# EAGLE design microSD_Shield-v13 (EAGLE 5.01)
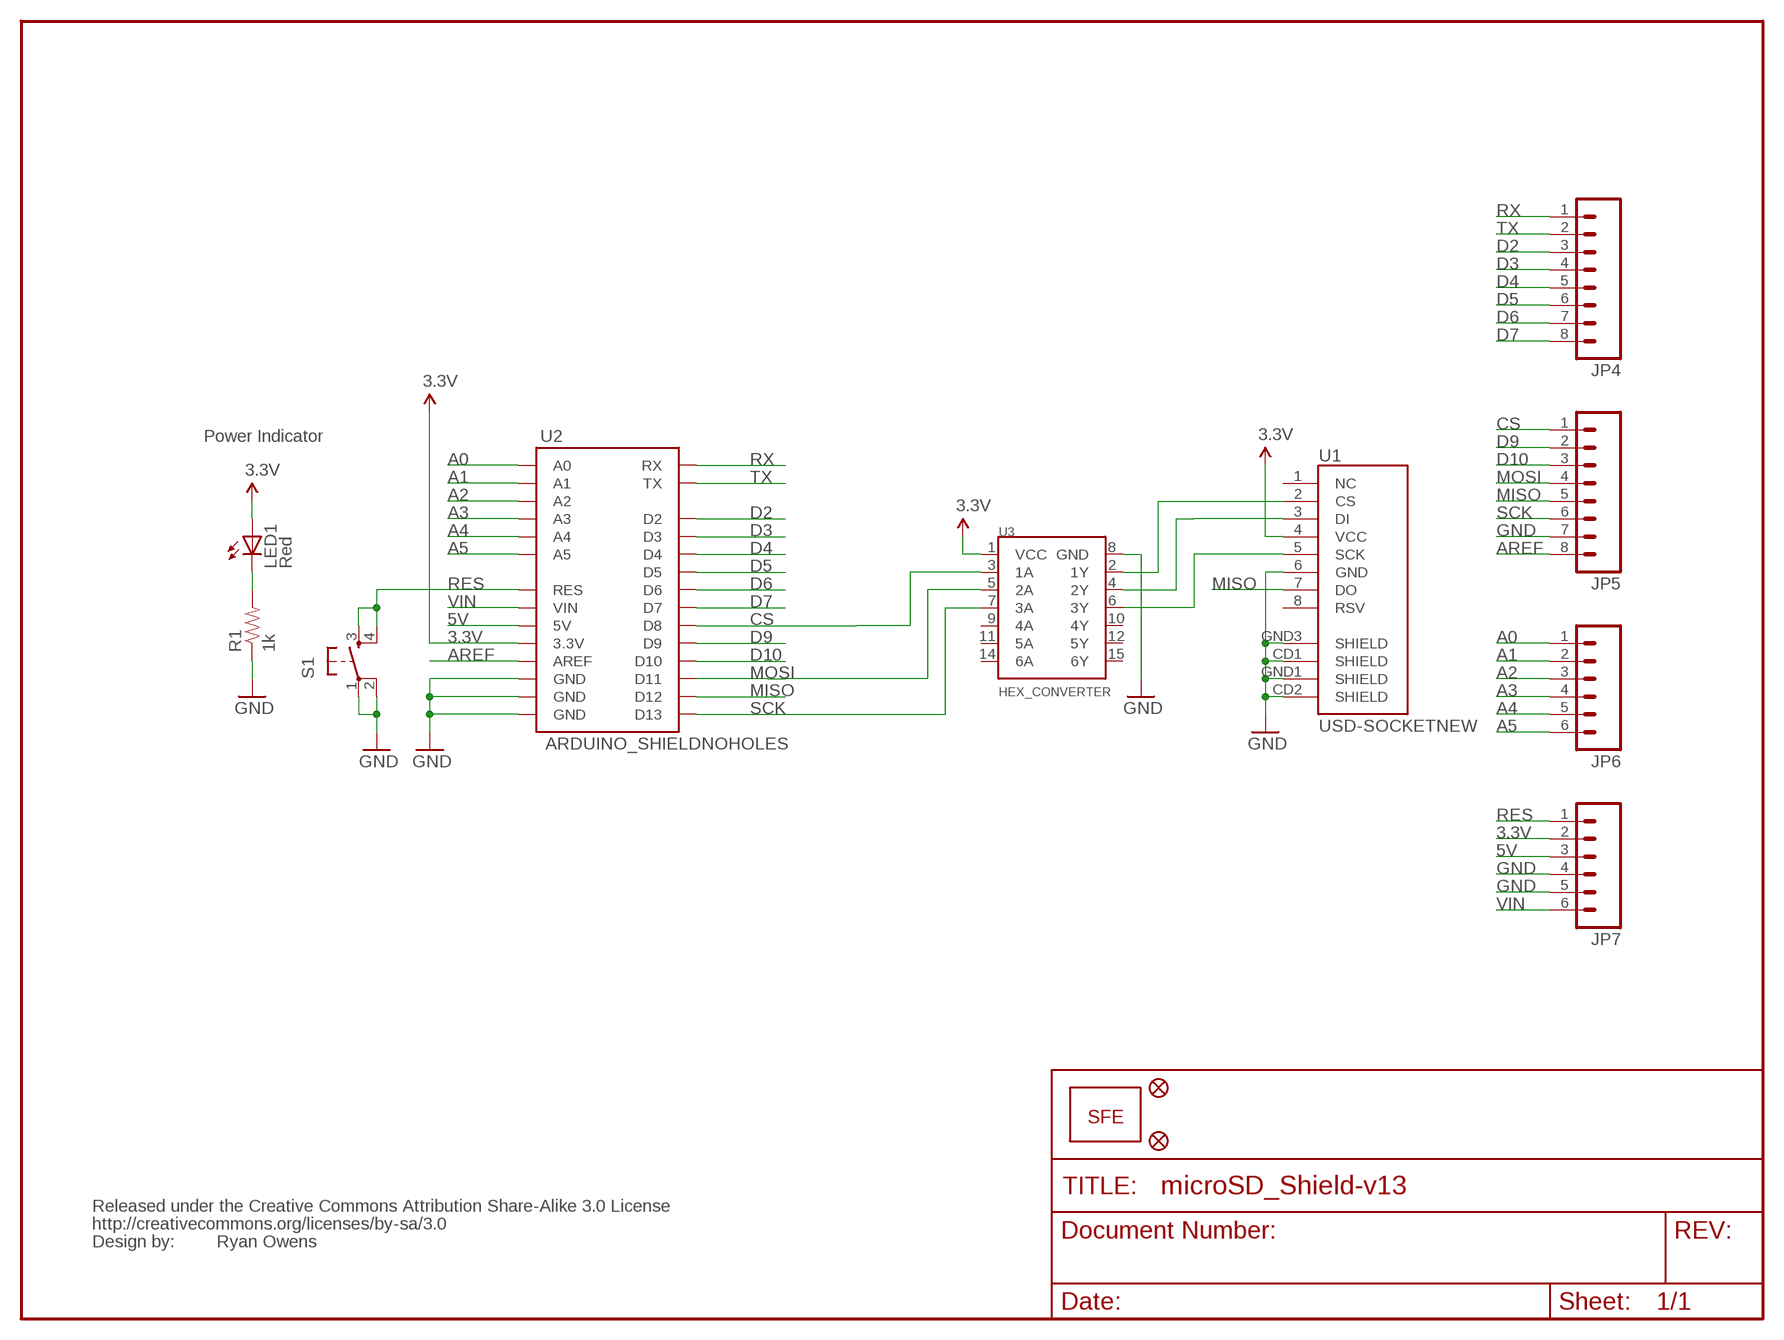
[diagram p0: schematic, sheet 1]

## Parts
JP1  LOGO-SFENEW  [SFE-NEW-WEBLOGO]
JP2  FIDUCIAL1X2  [FIDUCIAL-1X2]
JP3  FIDUCIAL1X2  [FIDUCIAL-1X2]
JP4  M08  [1X08]
JP5  M08  [1X08]
JP6  M06SIP  [1X06]
JP7  M06SIP  [1X06]
LED1  Red  LED0603  [LED-0603]
R1  1k  RESISTOR0603-RES  [0603-RES]
S1  TAC_SWITCHSMD  [TACTILE_SWITCH_SMD]
U1  USD-SOCKETNEW  [MICRO-SD-SOCKET-PP]
U2  ARDUINO_SHIELDNOHOLES  [DUEMILANOVE_SHIELD_NOHOLES]
U3  HEX_CONVERTER  [SO016]
U$1  CREATIVE_COMMONS  [CREATIVE_COMMONS]

## Nets
3.3V: JP7.2 LED1.A U1.4(VCC) U2.3.3V U3.1(VCC)
5V: JP7.3 U2.5V
A0: JP6.1 U2.A0
A1: JP6.2 U2.A1
A2: JP6.3 U2.A2
A3: JP6.4 U2.A3
A4: JP6.5 U2.A4
A5: JP6.6 U2.A5
AREF: JP5.8 U2.AREF
CS: JP5.1 U2.D8 U3.3(1A)
D2: JP4.3 U2.D2
D3: JP4.4 U2.D3
D4: JP4.5 U2.D4
D5: JP4.6 U2.D5
D6: JP4.7 U2.D6
D7: JP4.8 U2.D7
D9: JP5.2 U2.D9
D10: JP5.3 U2.D10
GND: JP5.7 JP7.4 JP7.5 R1.1 S1.1 S1.2 U1.6(GND) U1.CD1(SHIELD) U1.CD2(SHIELD) U1.GND1(SHIELD) U1.GND3(SHIELD) U2.GND@0(GND) U2.GND@1(GND) U2.GND@2(GND) U3.8(GND)
MISO: JP5.5 U1.7(DO) U2.D12
MOSI: JP5.4 U2.D11 U3.5(2A)
N$2: U1.3(DI) U3.4(2Y)
N$4: U1.5(SCK) U3.6(3Y)
N$6: LED1.C R1.2
N$163: U1.2(CS) U3.2(1Y)
RES: JP7.1 S1.3 S1.4 U2.RES
RX: JP4.1 U2.RX
SCK: JP5.6 U2.D13 U3.7(3A)
TX: JP4.2 U2.TX
VIN: JP7.6 U2.VIN
Unconnected: U1.1(NC) U1.8(RSV) U3.9(4A) U3.10(4Y) U3.11(5A) U3.12(5Y) U3.14(6A) U3.15(6Y)

## Notes on the sheet
- Power Indicator
- Ryan Owens

## Library data of the parts
JP1 = SparkFun:LOGO-SFE: Spark Fun Electronics PCB Logo This is the standard Spark Fun Electronics PCB logo.
JP2 JP3 = SparkFun:FIDUCIAL: Fiducial Alignment Points Various fiducial points for machine vision alignment.
JP4 JP5 = SparkFun:M08: Header 8 Standard 8-pin 0.1" header. Use with straight break away headers (SKU : PRT-00116), right angle break away headers (PRT-00553), swiss pins (PRT-00743), machine pins (PRT-00117), and female headers (PRT-00115).
JP6 JP7 = SparkFun:M06: Header 6 Standard 6-pin 0.1" header. Use with straight break away headers (SKU : PRT-00116), right angle break away headers (PRT-00553), swiss pins (PRT-00743), machine pins (PRT-00117), and female headers (PRT-00115). Molex polarized connector foot print use with SKU : PRT-08094 with associated crimp pins and housings. NOTES ON THE VARIANTS LOCK and LOCK_LONGPADS... This footprint was designed to help hold the alignment of a through-hole component (i.e. 6-pin header) while soldering it into place. You may notice that each hole has been shifted either up or down by 0.005 of an inch from it's more standard position (which is a perfectly straight line). This slight alteration caused the pins (the squares in the middle) to touch the edges of the holes. Because they are alternating, it causes a "brace" to hold the component in place. 0.005 has proven to be the perfect amount of "off-center" position when using our standard breakaway headers. Although looks a little odd when you look at the bare footprint, once you have a header in there, the alteration is very hard to notice. Also, if you push a header all the way into place, it is covered up entirely on the bottom side. This idea of altering the position of holes to aid alignment will be further integrated into the Sparkfun Library for other footprints. It can help hold any component with 3 or more connection pins.
LED1 = SparkFun:LED: LEDs Standard schematic elements and footprints for 5mm, 3mm, 1206, and 0603 sized LEDs. 5mm - Spark Fun Electronics SKU : COM-00529 (and others)
R1 = SparkFun:RESISTOR: Resistor Basic schematic elements and footprints for 0603, 1206, and PTH 1/10th watt (small) resistors.
S1 = SparkFun:TAC_SWITCH: Momentary Switch Button commonly used for reset or general input. Spark Fun Electronics SKU : COM-00097
U1 = SparkFun:USD-SOCKET: microSD Socket Push-push type uSD socket. Schematic element and footprint production proven. Spark Fun Electronics SKU : PRT-00127. tDoc lines correctly indicate media card edge positions when inserting (unlocked, locked, depressed).
U2 = SparkFun:ARDUINO_SHIELD
U3 = SparkFun:HEX_CONVERTER
U$1 = SparkFun:CREATIVE_COMMONS

## Board
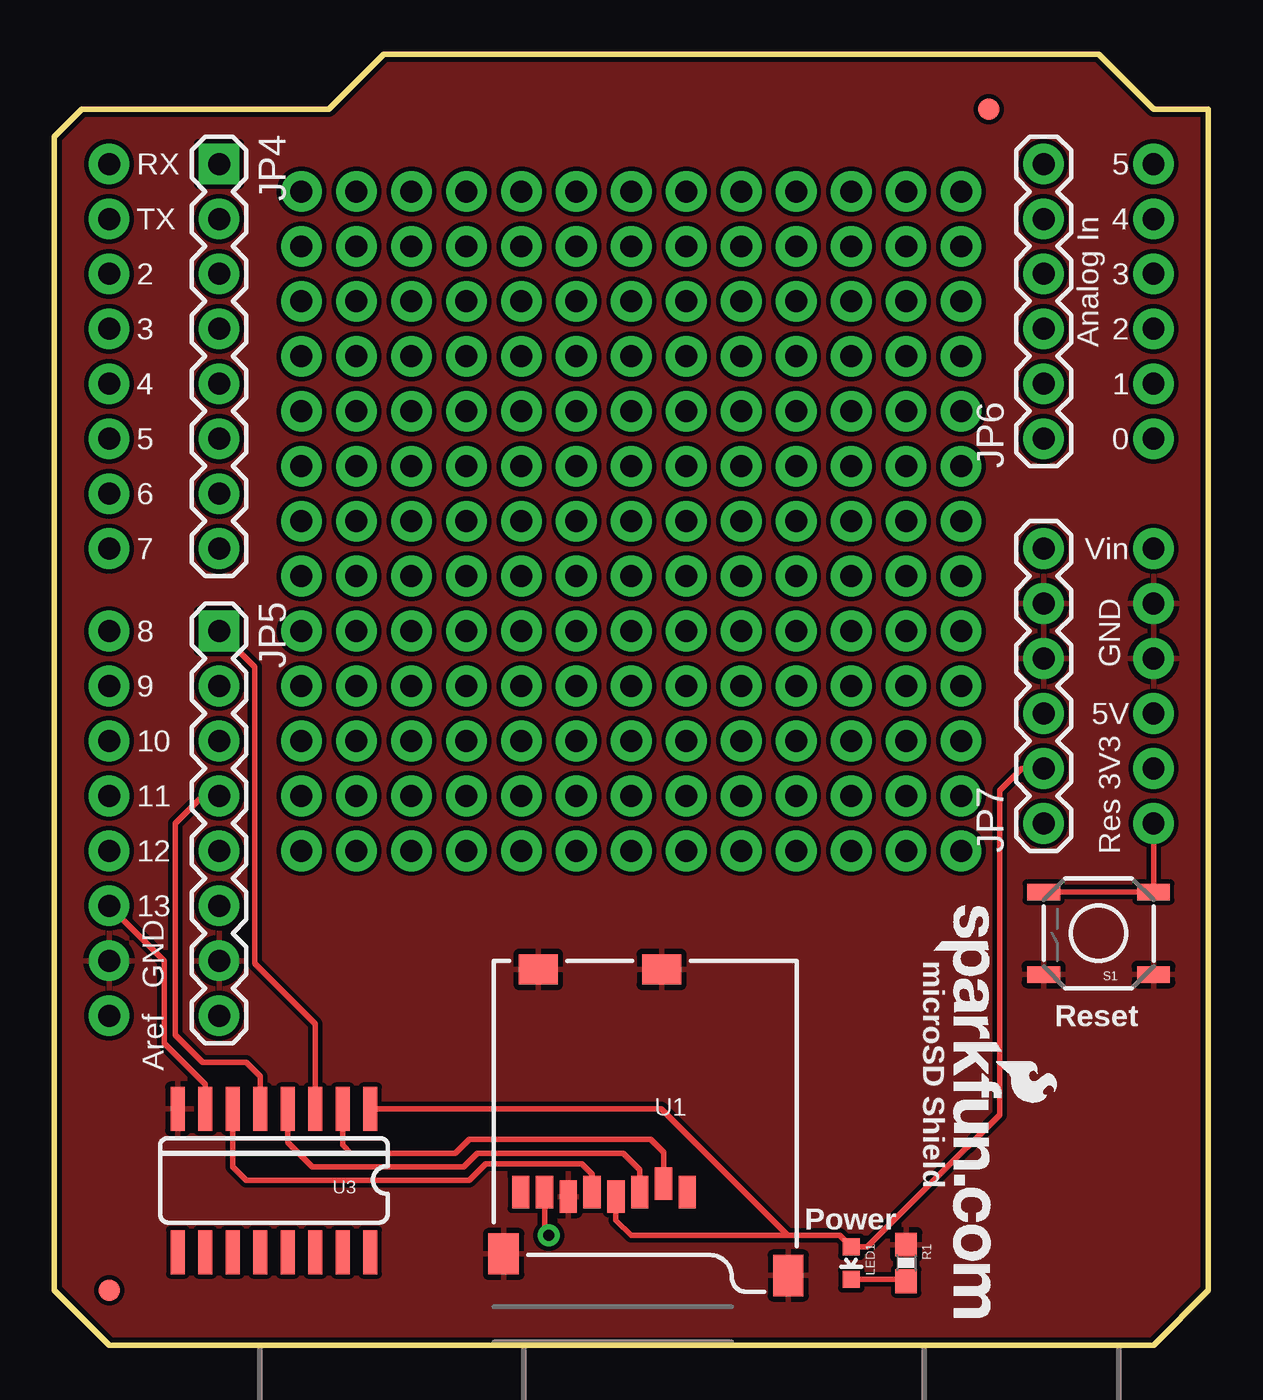
[diagram p1: board, top side]
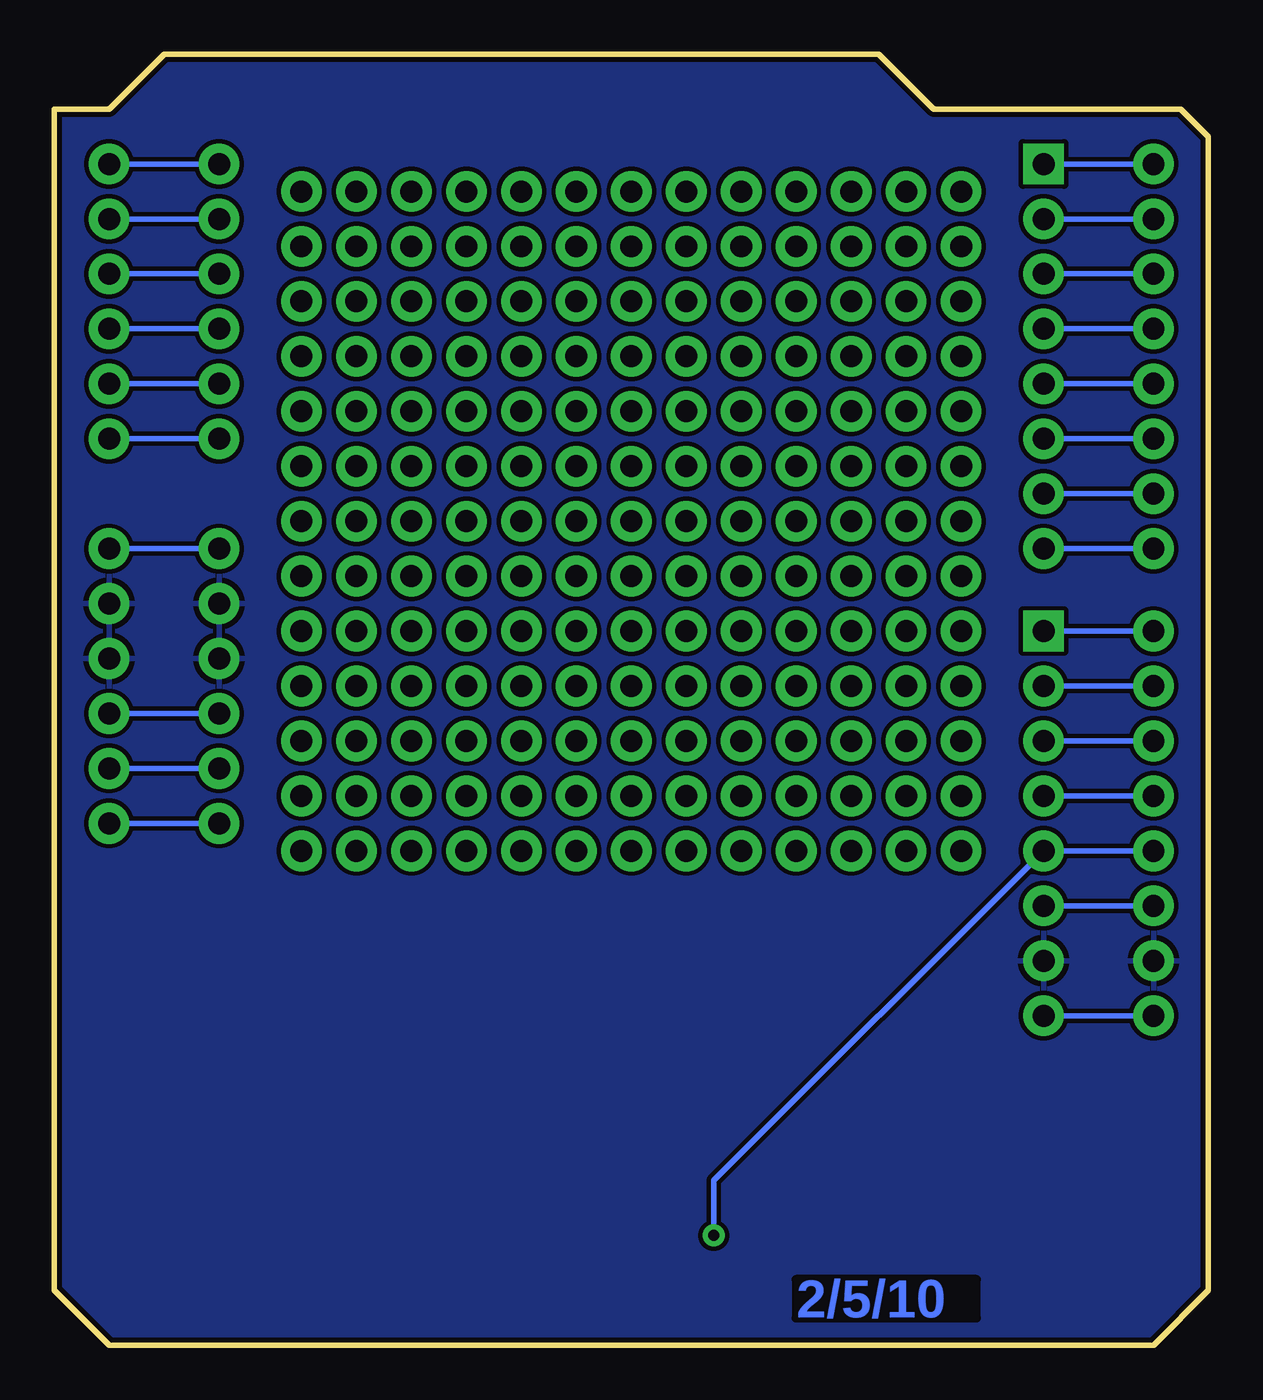
[diagram p2: board, bottom side, seen from below]

Size 53.34 x 59.69 mm. Coordinates in mm from the lower left corner, seen from the top.
Outline: 0,2.54 0,55.88 1.27,57.15 12.7,57.15 15.24,59.69 48.26,59.69 50.8,57.15 53.34,57.15 53.34,2.54 50.8,0 34.29,0 2.54,0 0,2.54
Copper layers (1*16): Top 0.035mm / dielectric 1.5mm / Bottom 0.035mm
Design rules "SparkFun": minimum track width 8mil, minimum drill 20mil, track to track 8mil, track to pad 8mil, pad to pad 8mil, via to via 8mil, smd to smd 8mil, copper to edge 9mil, drill to drill 8mil, minimum pad ring 12mil, minimum via ring 10mil, stop-mask expansion 4mil, vias tented up to drill 20mil, thermal gap 10mil

### Footprints (pad centres in the part's own frame; a part is rotated, then mirrored left to right if it is on the bottom)
FIDUCIAL-1X2 = smd 1 x 1: 1 0,0
1X08 = drill 1.016 pad 1.88 square: 1 0,0 | drill 1.016 pad 1.88 round: 2 2.54,0; 3 5.08,0; 4 7.62,0; 5 10.16,0; 6 12.7,0; 7 15.24,0; 8 17.78,0
1X06 = drill 1.016 pad 1.88 round: 1 0,0; 2 2.54,0; 3 5.08,0; 4 7.62,0; 5 10.16,0; 6 12.7,0
LED-0603 = smd 0.8 x 0.8: A 0,-0.75; C 0,0.75
0603-RES = smd 1.1 x 1: 1 -0.85,0; 2 0.85,0
TACTILE_SWITCH_SMD = smd 1.524 x 0.762: 1 -2.54,1.905; 2 2.54,1.905; 3 -2.54,-1.905; 4 2.54,-1.905
MICRO-SD-SOCKET-PP = smd 0.8 x 1.5: 1 -8.94,10.7; 2 -7.84,10.3; 3 -6.74,10.7; 4 -5.64,10.9; 5 -4.54,10.7; 6 -3.44,10.9; 7 -2.34,10.7; 8 -1.24,10.7 | smd 1.8 x 1.4: CD1 -2.05,0.4; CD2 -7.75,0.4 | smd 1.4 x 1.9: GND1 -13.6,14.55; GND3 -0.45,13.55
DUEMILANOVE_SHIELD_NOHOLES = drill 1.016 pad 1.88 round: 3.3V 50.8,26.67; 5V 50.8,29.21; A0 50.8,41.91; A1 50.8,44.45; A2 50.8,46.99; A3 50.8,49.53; A4 50.8,52.07; A5 50.8,54.61; AREF 2.54,15.24; D2 2.54,49.53; D3 2.54,46.99; D4 2.54,44.45; D5 2.54,41.91; D6 2.54,39.37; D7 2.54,36.83; D8 2.54,33.02; D9 2.54,30.48; D10 2.54,27.94; D11 2.54,25.4; D12 2.54,22.86; D13 2.54,20.32; GND@0 50.8,31.75; GND@1 50.8,34.29; GND@2 2.54,17.78; RES 50.8,24.13; RX 2.54,54.61; TX 2.54,52.07; VIN 50.8,36.83
SO016 = smd 0.66 x 2.032: 1 -4.445,-3.315; 2 -3.175,-3.315; 3 -1.905,-3.315; 4 -0.635,-3.315; 5 0.635,-3.315; 6 1.905,-3.315; 7 3.175,-3.315; 8 4.445,-3.315; 9 4.445,3.315; 10 3.175,3.315; 11 1.905,3.315; 12 0.635,3.315; 13 -0.635,3.315; 14 -1.905,3.315; 15 -3.175,3.315; 16 -4.445,3.315

### Placement (x,y rotation side)
JP1  40.64,20.32 270 top
JP2  2.54,2.54 0 top
JP3  43.18,57.15 0 top
JP4  7.62,54.61 270 top
JP5  7.62,33.02 270 top
JP6  45.72,41.91 90 top
JP7  45.72,24.13 90 top
LED1  36.83,3.81 180 top
R1  39.37,3.81 270 top
S1  48.26,19.05 180 top
U1  20.32,17.78 180 top
U2  0,0 0 top
U3  10.16,7.62 180 top
U$1  0,-11.43 0 top  (outside the outline)

### Tracks (layer width: path | path; a pad name or v marks a point on that pad's centre or on a via)
3.3V
  Top 0.254: U1.4 25.96,5.79 26.67,5.08 33.91,5.08 | 33.91,5.08 36.31,5.08 LED1.A 37.58,4.56 40.64,7.62 43.69,10.67 43.69,25.65 44.7,26.67 JP7.2 | U3.1 28.05,10.94 33.91,5.08
  Bottom 0.254: JP7.2 U2.3.3V
5V
  Bottom 0.254: JP7.3 U2.5V
A0
  Bottom 0.254: JP6.1 U2.A0
A1
  Bottom 0.254: JP6.2 U2.A1
A2
  Bottom 0.254: JP6.3 U2.A2
A3
  Bottom 0.254: JP6.4 U2.A3
A4
  Bottom 0.254: JP6.5 U2.A4
A5
  Bottom 0.254: JP6.6 U2.A5
AREF
  Bottom 0.254: U2.AREF JP5.8
CS
  Top 0.254: U3.3 12.06,14.61 12.06,14.86 9.53,17.4 9.27,17.65 9.27,30.1 9.27,31.37 JP5.1
  Bottom 0.254: JP5.1 U2.D8
D2
  Bottom 0.254: U2.D2 JP4.3
D3
  Bottom 0.254: U2.D3 JP4.4
D4
  Bottom 0.254: U2.D4 JP4.5
D5
  Bottom 0.254: U2.D5 JP4.6
D6
  Bottom 0.254: U2.D6 JP4.7
D7
  Bottom 0.254: U2.D7 JP4.8
D9
  Bottom 0.254: U2.D9 JP5.2
D10
  Bottom 0.254: U2.D10 JP5.3
GND
  pour Bottom: 2.54,0 0,2.54 0,55.88 1.27,57.15 12.7,57.15 15.24,59.69 48.26,59.69 50.8,57.15 53.34,57.15 53.34,2.54 50.8,0
  pour Top: 2.54,0 0,2.54 0,55.88 1.27,57.15 12.7,57.15 15.24,59.69 48.26,59.69 50.8,57.15 53.34,57.15 53.34,2.54 50.8,0
MISO  (via drill 0.51)
  Top 0.254: U1.7 22.66,5.28 v22.86,5.08
  Bottom 0.254: U2.D12 JP5.5 22.86,7.62 v22.86,5.08
MOSI
  Top 0.254: JP5.4 6.86,25.4 5.59,24.13 5.59,14.35 6.86,13.08 6.98,13.08 8.89,13.08 9.53,12.45 U3.5
  Bottom 0.254: JP5.4 U2.D11
N$2
  Top 0.254: U3.4 10.79,9.4 11.94,8.26 18.92,8.26 19.43,8.76 19.56,8.89 20.7,8.89 21.08,8.89 26.29,8.89 27.06,8.12 U1.3
N$3  (via drill 1.02 pad 1.88)
  other vias: 11.43,53.34
N$4
  Top 0.254: U3.6 8.26,8.26 8.89,7.62 19.18,7.62 19.94,8.38 20.32,8.38 20.7,8.38 24.38,8.38 24.86,7.91 U1.5
N$5  (via drill 1.02 pad 1.88)
  other vias: 41.91,50.8
N$6
  Top 0.254: R1.2 39.37,3.17 39.26,3.06 LED1.C
N$7  (via drill 1.02 pad 1.88)
  other vias: 39.37,50.8
N$9  (via drill 1.02 pad 1.88)
  other vias: 36.83,50.8
N$10  (via drill 1.02 pad 1.88)
  other vias: 34.29,50.8
N$11  (via drill 1.02 pad 1.88)
  other vias: 31.75,50.8
N$12  (via drill 1.02 pad 1.88)
  other vias: 29.21,50.8
N$13  (via drill 1.02 pad 1.88)
  other vias: 26.67,50.8
N$14  (via drill 1.02 pad 1.88)
  other vias: 24.13,50.8
N$15  (via drill 1.02 pad 1.88)
  other vias: 21.59,50.8
N$16  (via drill 1.02 pad 1.88)
  other vias: 19.05,50.8
N$17  (via drill 1.02 pad 1.88)
  other vias: 16.51,50.8
N$18  (via drill 1.02 pad 1.88)
  other vias: 13.97,50.8
N$19  (via drill 1.02 pad 1.88)
  other vias: 11.43,50.8
N$20  (via drill 1.02 pad 1.88)
  other vias: 11.43,48.26
N$21  (via drill 1.02 pad 1.88)
  other vias: 13.97,48.26
N$22  (via drill 1.02 pad 1.88)
  other vias: 16.51,48.26
N$23  (via drill 1.02 pad 1.88)
  other vias: 19.05,48.26
N$24  (via drill 1.02 pad 1.88)
  other vias: 21.59,48.26
N$25  (via drill 1.02 pad 1.88)
  other vias: 24.13,48.26
N$26  (via drill 1.02 pad 1.88)
  other vias: 26.67,48.26
N$27  (via drill 1.02 pad 1.88)
  other vias: 29.21,48.26
N$28  (via drill 1.02 pad 1.88)
  other vias: 31.75,48.26
N$29  (via drill 1.02 pad 1.88)
  other vias: 34.29,48.26
N$30  (via drill 1.02 pad 1.88)
  other vias: 36.83,48.26
N$31  (via drill 1.02 pad 1.88)
  other vias: 39.37,48.26
N$32  (via drill 1.02 pad 1.88)
  other vias: 41.91,48.26
N$33  (via drill 1.02 pad 1.88)
  other vias: 41.91,45.72
N$34  (via drill 1.02 pad 1.88)
  other vias: 39.37,45.72
N$35  (via drill 1.02 pad 1.88)
  other vias: 36.83,45.72
N$36  (via drill 1.02 pad 1.88)
  other vias: 34.29,45.72
N$37  (via drill 1.02 pad 1.88)
  other vias: 31.75,45.72
N$38  (via drill 1.02 pad 1.88)
  other vias: 29.21,45.72
N$39  (via drill 1.02 pad 1.88)
  other vias: 26.67,45.72
N$40  (via drill 1.02 pad 1.88)
  other vias: 24.13,45.72
N$41  (via drill 1.02 pad 1.88)
  other vias: 21.59,45.72
N$42  (via drill 1.02 pad 1.88)
  other vias: 19.05,45.72
N$43  (via drill 1.02 pad 1.88)
  other vias: 16.51,45.72
N$44  (via drill 1.02 pad 1.88)
  other vias: 13.97,45.72
N$45  (via drill 1.02 pad 1.88)
  other vias: 11.43,45.72
N$46  (via drill 1.02 pad 1.88)
  other vias: 11.43,43.18
N$47  (via drill 1.02 pad 1.88)
  other vias: 13.97,43.18
N$48  (via drill 1.02 pad 1.88)
  other vias: 16.51,43.18
N$49  (via drill 1.02 pad 1.88)
  other vias: 19.05,43.18
N$50  (via drill 1.02 pad 1.88)
  other vias: 21.59,43.18
N$51  (via drill 1.02 pad 1.88)
  other vias: 24.13,43.18
N$52  (via drill 1.02 pad 1.88)
  other vias: 26.67,43.18
N$53  (via drill 1.02 pad 1.88)
  other vias: 29.21,43.18
N$54  (via drill 1.02 pad 1.88)
  other vias: 31.75,43.18
N$55  (via drill 1.02 pad 1.88)
  other vias: 34.29,43.18
N$56  (via drill 1.02 pad 1.88)
  other vias: 36.83,43.18
N$57  (via drill 1.02 pad 1.88)
  other vias: 39.37,43.18
N$58  (via drill 1.02 pad 1.88)
  other vias: 41.91,43.18
N$59  (via drill 1.02 pad 1.88)
  other vias: 41.91,40.64
N$60  (via drill 1.02 pad 1.88)
  other vias: 39.37,40.64
N$61  (via drill 1.02 pad 1.88)
  other vias: 36.83,40.64
N$62  (via drill 1.02 pad 1.88)
  other vias: 34.29,40.64
N$63  (via drill 1.02 pad 1.88)
  other vias: 31.75,40.64
N$64  (via drill 1.02 pad 1.88)
  other vias: 29.21,40.64
N$65  (via drill 1.02 pad 1.88)
  other vias: 26.67,40.64
N$66  (via drill 1.02 pad 1.88)
  other vias: 24.13,40.64
N$67  (via drill 1.02 pad 1.88)
  other vias: 21.59,40.64
N$68  (via drill 1.02 pad 1.88)
  other vias: 19.05,40.64
N$69  (via drill 1.02 pad 1.88)
  other vias: 16.51,40.64
N$70  (via drill 1.02 pad 1.88)
  other vias: 13.97,40.64
N$71  (via drill 1.02 pad 1.88)
  other vias: 11.43,40.64
N$72  (via drill 1.02 pad 1.88)
  other vias: 11.43,38.1
N$73  (via drill 1.02 pad 1.88)
  other vias: 13.97,38.1
N$74  (via drill 1.02 pad 1.88)
  other vias: 16.51,38.1
N$75  (via drill 1.02 pad 1.88)
  other vias: 19.05,38.1
N$76  (via drill 1.02 pad 1.88)
  other vias: 21.59,38.1
N$77  (via drill 1.02 pad 1.88)
  other vias: 24.13,38.1
N$78  (via drill 1.02 pad 1.88)
  other vias: 26.67,38.1
N$79  (via drill 1.02 pad 1.88)
  other vias: 29.21,38.1
N$80  (via drill 1.02 pad 1.88)
  other vias: 31.75,38.1
N$81  (via drill 1.02 pad 1.88)
  other vias: 34.29,38.1
N$82  (via drill 1.02 pad 1.88)
  other vias: 36.83,38.1
N$83  (via drill 1.02 pad 1.88)
  other vias: 39.37,38.1
N$84  (via drill 1.02 pad 1.88)
  other vias: 41.91,38.1
N$85  (via drill 1.02 pad 1.88)
  other vias: 41.91,35.56
N$86  (via drill 1.02 pad 1.88)
  other vias: 39.37,35.56
N$87  (via drill 1.02 pad 1.88)
  other vias: 36.83,35.56
N$88  (via drill 1.02 pad 1.88)
  other vias: 34.29,35.56
N$89  (via drill 1.02 pad 1.88)
  other vias: 31.75,35.56
N$90  (via drill 1.02 pad 1.88)
  other vias: 29.21,35.56
N$91  (via drill 1.02 pad 1.88)
  other vias: 26.67,35.56
N$92  (via drill 1.02 pad 1.88)
  other vias: 24.13,35.56
N$93  (via drill 1.02 pad 1.88)
  other vias: 21.59,35.56
N$94  (via drill 1.02 pad 1.88)
  other vias: 19.05,35.56
N$95  (via drill 1.02 pad 1.88)
  other vias: 16.51,35.56
N$96  (via drill 1.02 pad 1.88)
  other vias: 13.97,35.56
N$97  (via drill 1.02 pad 1.88)
  other vias: 11.43,35.56
N$98  (via drill 1.02 pad 1.88)
  other vias: 11.43,33.02
N$99  (via drill 1.02 pad 1.88)
  other vias: 13.97,33.02
N$100  (via drill 1.02 pad 1.88)
  other vias: 16.51,33.02
N$101  (via drill 1.02 pad 1.88)
  other vias: 19.05,33.02
N$102  (via drill 1.02 pad 1.88)
  other vias: 21.59,33.02
N$103  (via drill 1.02 pad 1.88)
  other vias: 24.13,33.02
N$104  (via drill 1.02 pad 1.88)
  other vias: 26.67,33.02
N$105  (via drill 1.02 pad 1.88)
  other vias: 29.21,33.02
N$106  (via drill 1.02 pad 1.88)
  other vias: 31.75,33.02
N$107  (via drill 1.02 pad 1.88)
  other vias: 34.29,33.02
N$108  (via drill 1.02 pad 1.88)
  other vias: 36.83,33.02
N$109  (via drill 1.02 pad 1.88)
  other vias: 39.37,33.02
N$110  (via drill 1.02 pad 1.88)
  other vias: 41.91,33.02
N$111  (via drill 1.02 pad 1.88)
  other vias: 41.91,30.48
N$112  (via drill 1.02 pad 1.88)
  other vias: 39.37,30.48
N$113  (via drill 1.02 pad 1.88)
  other vias: 36.83,30.48
N$114  (via drill 1.02 pad 1.88)
  other vias: 34.29,30.48
N$115  (via drill 1.02 pad 1.88)
  other vias: 31.75,30.48
N$116  (via drill 1.02 pad 1.88)
  other vias: 29.21,30.48
N$117  (via drill 1.02 pad 1.88)
  other vias: 26.67,30.48
N$118  (via drill 1.02 pad 1.88)
  other vias: 24.13,30.48
N$119  (via drill 1.02 pad 1.88)
  other vias: 21.59,30.48
N$120  (via drill 1.02 pad 1.88)
  other vias: 19.05,30.48
N$121  (via drill 1.02 pad 1.88)
  other vias: 16.51,30.48
N$122  (via drill 1.02 pad 1.88)
  other vias: 13.97,30.48
N$123  (via drill 1.02 pad 1.88)
  other vias: 11.43,30.48
N$124  (via drill 1.02 pad 1.88)
  other vias: 11.43,27.94
N$125  (via drill 1.02 pad 1.88)
  other vias: 13.97,27.94
N$126  (via drill 1.02 pad 1.88)
  other vias: 16.51,27.94
N$127  (via drill 1.02 pad 1.88)
  other vias: 19.05,27.94
N$128  (via drill 1.02 pad 1.88)
  other vias: 21.59,27.94
N$129  (via drill 1.02 pad 1.88)
  other vias: 24.13,27.94
N$130  (via drill 1.02 pad 1.88)
  other vias: 26.67,27.94
N$131  (via drill 1.02 pad 1.88)
  other vias: 29.21,27.94
N$132  (via drill 1.02 pad 1.88)
  other vias: 31.75,27.94
N$133  (via drill 1.02 pad 1.88)
  other vias: 34.29,27.94
N$134  (via drill 1.02 pad 1.88)
  other vias: 36.83,27.94
N$135  (via drill 1.02 pad 1.88)
  other vias: 39.37,27.94
N$136  (via drill 1.02 pad 1.88)
  other vias: 41.91,27.94
N$137  (via drill 1.02 pad 1.88)
  other vias: 41.91,25.4
N$138  (via drill 1.02 pad 1.88)
  other vias: 39.37,25.4
N$139  (via drill 1.02 pad 1.88)
  other vias: 36.83,25.4
N$140  (via drill 1.02 pad 1.88)
  other vias: 34.29,25.4
N$141  (via drill 1.02 pad 1.88)
  other vias: 31.75,25.4
N$142  (via drill 1.02 pad 1.88)
  other vias: 29.21,25.4
N$143  (via drill 1.02 pad 1.88)
  other vias: 26.67,25.4
N$144  (via drill 1.02 pad 1.88)
  other vias: 24.13,25.4
N$145  (via drill 1.02 pad 1.88)
  other vias: 21.59,25.4
N$146  (via drill 1.02 pad 1.88)
  other vias: 19.05,25.4
N$147  (via drill 1.02 pad 1.88)
  other vias: 16.51,25.4
N$148  (via drill 1.02 pad 1.88)
  other vias: 13.97,25.4
N$149  (via drill 1.02 pad 1.88)
  other vias: 11.43,25.4
N$150  (via drill 1.02 pad 1.88)
  other vias: 11.43,22.86
N$151  (via drill 1.02 pad 1.88)
  other vias: 13.97,22.86
N$152  (via drill 1.02 pad 1.88)
  other vias: 16.51,22.86
N$153  (via drill 1.02 pad 1.88)
  other vias: 19.05,22.86
N$154  (via drill 1.02 pad 1.88)
  other vias: 21.59,22.86
N$155  (via drill 1.02 pad 1.88)
  other vias: 24.13,22.86
N$156  (via drill 1.02 pad 1.88)
  other vias: 26.67,22.86
N$157  (via drill 1.02 pad 1.88)
  other vias: 29.21,22.86
N$158  (via drill 1.02 pad 1.88)
  other vias: 31.75,22.86
N$159  (via drill 1.02 pad 1.88)
  other vias: 34.29,22.86
N$160  (via drill 1.02 pad 1.88)
  other vias: 36.83,22.86
N$161  (via drill 1.02 pad 1.88)
  other vias: 39.37,22.86
N$162  (via drill 1.02 pad 1.88)
  other vias: 41.91,22.86
N$163
  Top 0.254: U3.2 13.33,9.27 13.72,8.89 18.54,8.89 19.18,9.53 25.53,9.53 25.91,9.53 27.56,9.53 28.16,8.92 U1.2
N$167  (via drill 1.02 pad 1.88)
  other vias: 13.97,53.34
N$168  (via drill 1.02 pad 1.88)
  other vias: 16.51,53.34
N$169  (via drill 1.02 pad 1.88)
  other vias: 19.05,53.34
N$170  (via drill 1.02 pad 1.88)
  other vias: 21.59,53.34
N$171  (via drill 1.02 pad 1.88)
  other vias: 24.13,53.34
N$172  (via drill 1.02 pad 1.88)
  other vias: 26.67,53.34
N$173  (via drill 1.02 pad 1.88)
  other vias: 29.21,53.34
N$174  (via drill 1.02 pad 1.88)
  other vias: 31.75,53.34
N$175  (via drill 1.02 pad 1.88)
  other vias: 34.29,53.34
N$176  (via drill 1.02 pad 1.88)
  other vias: 36.83,53.34
N$177  (via drill 1.02 pad 1.88)
  other vias: 39.37,53.34
N$178  (via drill 1.02 pad 1.88)
  other vias: 41.91,53.34
RES
  Top 0.254: S1.4 49.15,20.95 49.28,20.95 S1.3 U2.RES
  Bottom 0.254: U2.RES JP7.1
RX
  Bottom 0.254: U2.RX 6.35,54.61 JP4.1
SCK
  Top 0.254: U3.7 6.98,12.06 6.35,12.7 5.08,13.97 5.08,15.24 5.08,17.78 U2.D13
  Bottom 0.254: U2.D13 JP5.6
TX
  Bottom 0.254: U2.TX JP4.2
VIN
  Bottom 0.254: JP7.6 U2.VIN

### Text on the board
Bottom: 2/5/10
tPlace: microSD Shield | Reset | Power
tValues: Ryan Owens